# EAGLE design quad-wireless-switch (EAGLE 9.3.0)
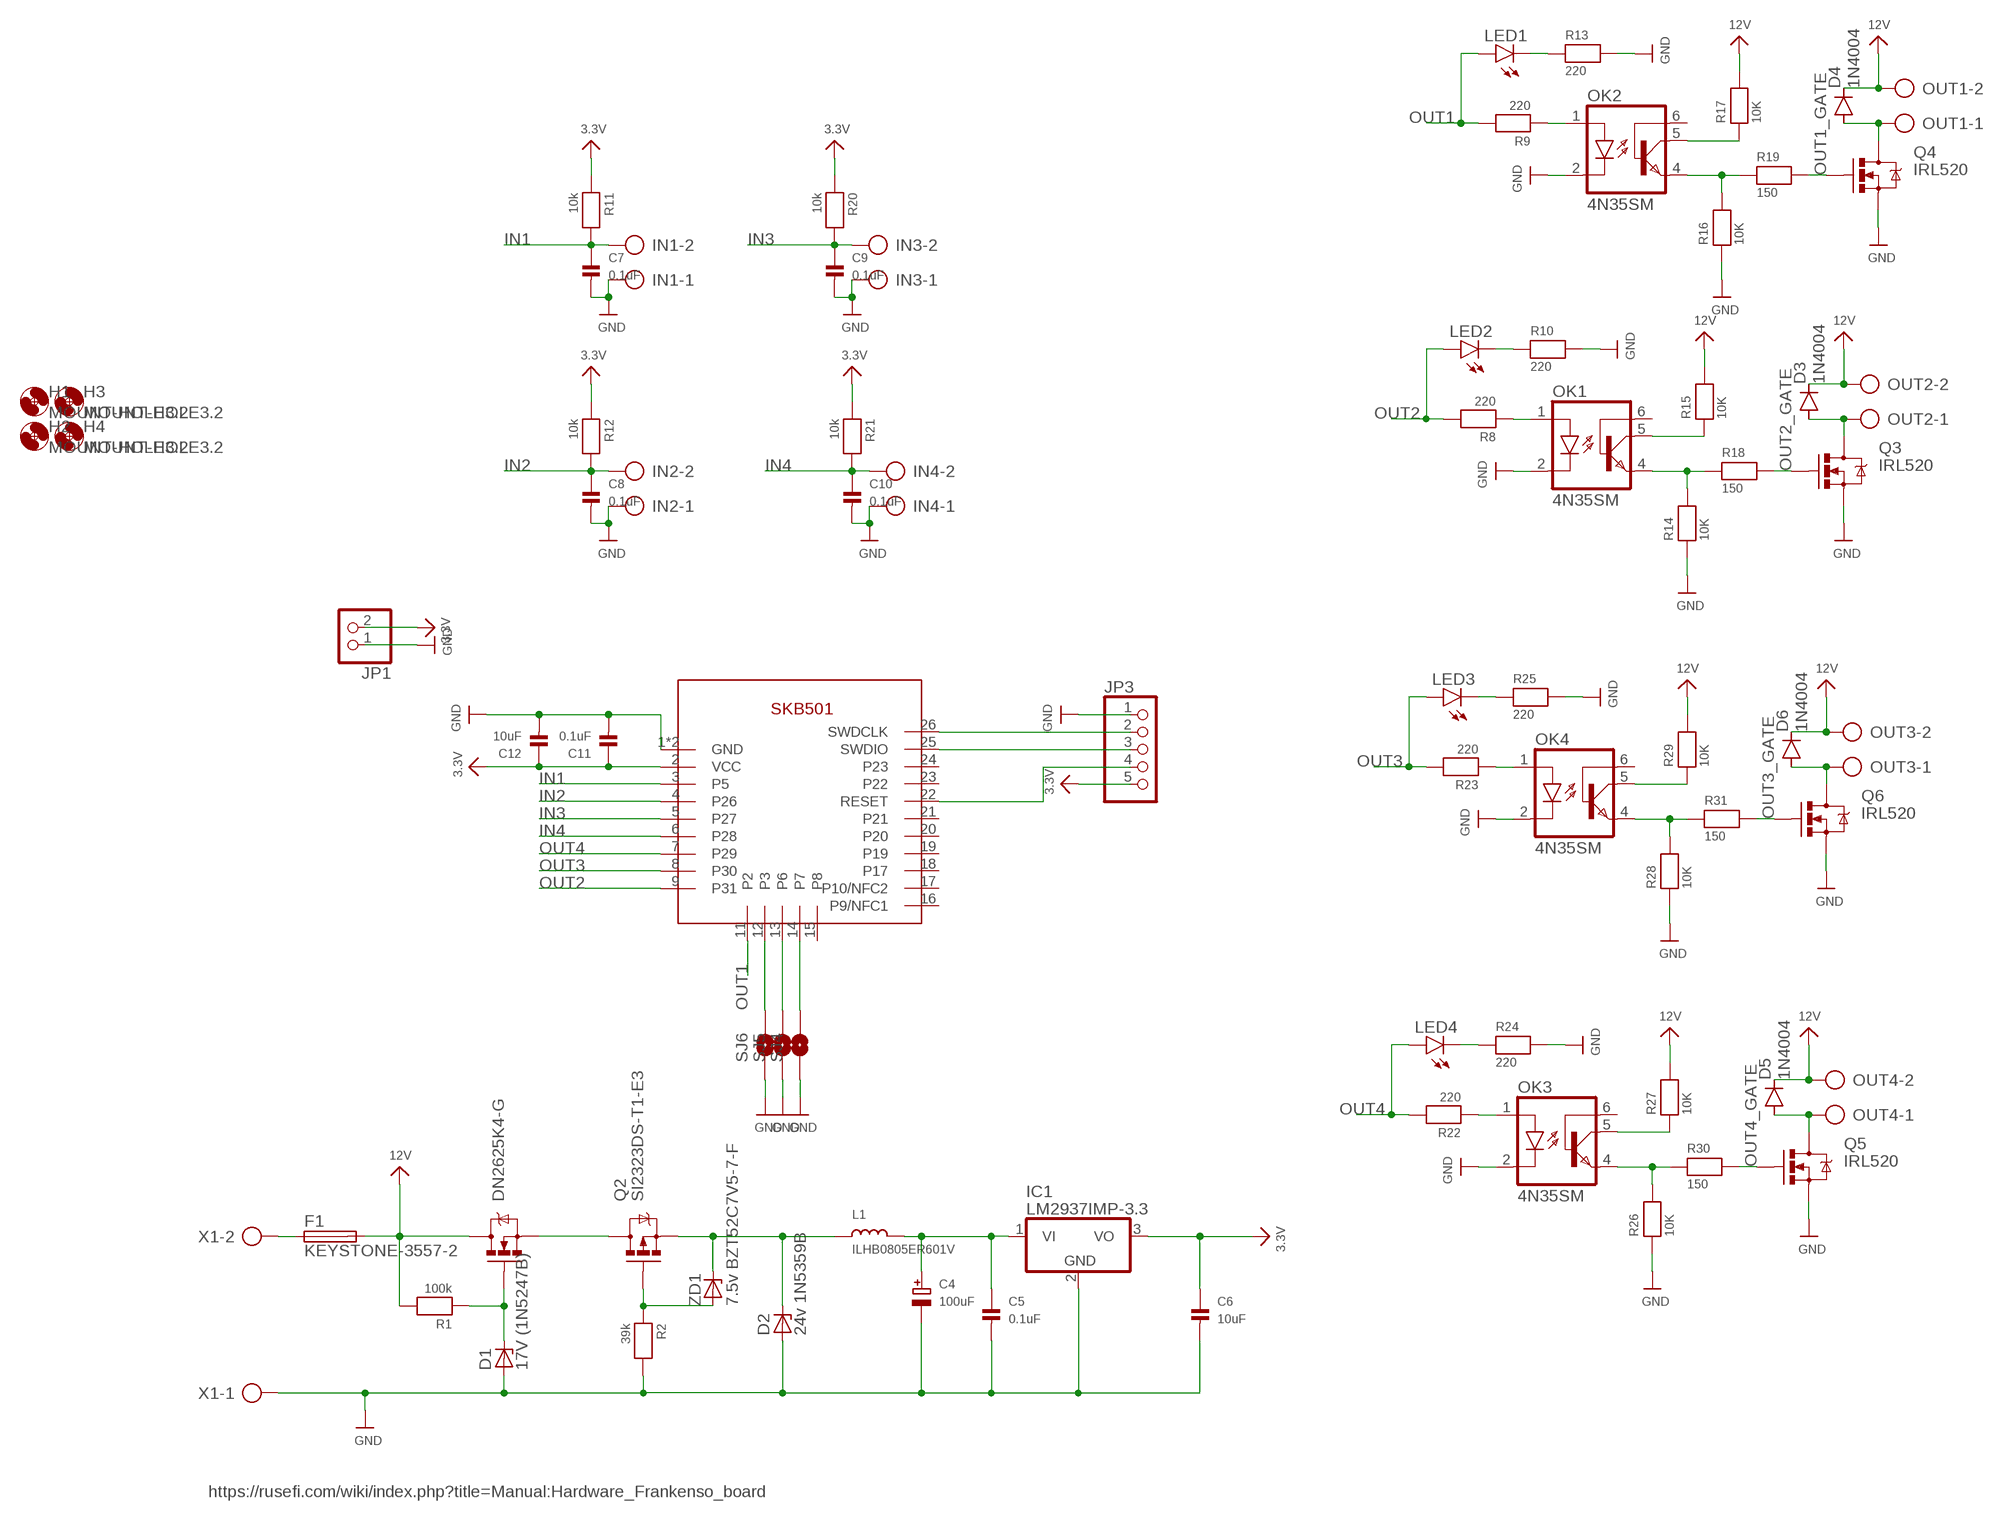
[diagram p0: schematic, sheet 1]

## Parts
C4  100uF  CAP_ELECTROLYTICPANASONIC_D  [PANASONIC_D]
C5  0.1uF  CAP_CERAMIC0805  [0805]
C6  10uF  CAP_CERAMIC0805  [0805]
C7  0.1uF  CAP_CERAMIC0805  [0805]
C8  0.1uF  CAP_CERAMIC0805  [0805]
C9  0.1uF  CAP_CERAMIC0805  [0805]
C10  0.1uF  CAP_CERAMIC0805  [0805]
C11  0.1uF  CAP_CERAMIC0805  [0805]
C12  10uF  CAP_CERAMIC0805  [0805]
D1  17V (1N5247B)  ZENER-DIODEZD-5  [ZDIO-5]
D2  24v 1N5359B  ZPY  [DO41Z10]
D3  1N4004  [DO41-10]
D4  1N4004  [DO41-10]
D5  1N4004  [DO41-10]
D6  1N4004  [DO41-10]
F1  KEYSTONE-3557-2  [KEYSTONE-3557-2]
H1  MOUNT-HOLE3.2  [3,2]
H2  MOUNT-HOLE3.2  [3,2]
H3  MOUNT-HOLE3.2  [3,2]
H4  MOUNT-HOLE3.2  [3,2]
IC1  LM2937IMP-3.3  LM2937  [TO263-3]
IN1  AK500/2-H  [AK500/2-H]
IN2  AK500/2-H  [AK500/2-H]
IN3  AK500/2-H  [AK500/2-H]
IN4  AK500/2-H  [AK500/2-H]
JP1  PINHD-1X2  [1X02]
JP3  PINHD-1X5  [1X05]
L1  ILHB0805ER601V  INDUCTOR0805  [0805]
LED1  LED5MM  [LED5MM]
LED2  LED5MM  [LED5MM]
LED3  LED5MM  [LED5MM]
LED4  LED5MM  [LED5MM]
OK1  4N35SM  [DIL6-SMD]
OK2  4N35SM  [DIL6-SMD]
OK3  4N35SM  [DIL6-SMD]
OK4  4N35SM  [DIL6-SMD]
OUT1  AK500/2-H  [AK500/2-H]
OUT2  AK500/2-H  [AK500/2-H]
OUT3  AK500/2-H  [AK500/2-H]
OUT4  AK500/2-H  [AK500/2-H]
Q1  DN2625K4-G  MOSFET-NCHANNELFDD8780  [DPAK]
Q2  SI2323DS-T1-E3  MOSFET-PCHANNEL  [SOT23-3]
Q3  IRL520  MOSFET-NCHANNELFQP30N06L  [TO220V]
Q4  IRL520  MOSFET-NCHANNELFQP30N06L  [TO220V]
Q5  IRL520  MOSFET-NCHANNELFQP30N06L  [TO220V]
Q6  IRL520  MOSFET-NCHANNELFQP30N06L  [TO220V]
R1  100k  RESISTOR0805  [0805]
R2  39k  RESISTOR0805  [0805]
R8  220  RESISTOR0805  [0805]
R9  220  RESISTOR0805  [0805]
R10  220  RESISTOR0805  [0805]
R11  10k  RESISTOR0805  [0805]
R12  10k  RESISTOR0805  [0805]
R13  220  RESISTOR0805  [0805]
R14  10K  RESISTOR0805  [0805]
R15  10K  RESISTOR0805  [0805]
R16  10K  RESISTOR0805  [0805]
R17  10K  RESISTOR0805  [0805]
R18  150  RESISTOR0805  [0805]
R19  150  RESISTOR0805  [0805]
R20  10k  RESISTOR0805  [0805]
R21  10k  RESISTOR0805  [0805]
R22  220  RESISTOR0805  [0805]
R23  220  RESISTOR0805  [0805]
R24  220  RESISTOR0805  [0805]
R25  220  RESISTOR0805  [0805]
R26  10K  RESISTOR0805  [0805]
R27  10K  RESISTOR0805  [0805]
R28  10K  RESISTOR0805  [0805]
R29  10K  RESISTOR0805  [0805]
R30  150  RESISTOR0805  [0805]
R31  150  RESISTOR0805  [0805]
SJ4  SOLDERJUMPERNO  [SJ_2S-NO]
SJ5  SOLDERJUMPERNO  [SJ_2S-NO]
SJ6  SOLDERJUMPERNO  [SJ_2S-NO]
U2  SDB501  [SKB501]
X1  AK500/2-H  [AK500/2-H]
ZD1  7.5v BZT52C7V5-7-F  ZD-SOD123  [SOD123]

## Nets
3.3V: C6.1 C11.1 C12.1 IC1.3(VO) JP1.2 JP3.5 R11.1 R12.1 R20.1 R21.1 U2.2(VCC)
12V: D3.C D4.C D5.C D6.C F1.R1 F1.R2 OUT1.2 OUT2.2 OUT3.2 OUT4.2 Q1.4(D) R1.2 R15.2 R17.2 R27.2 R29.2
GND: C4.- C5.2 C6.2 C7.2 C8.2 C9.2 C10.2 C11.2 C12.2 D1.A D2.A IC1.2(GND) IN1.1 IN2.1 IN3.1 IN4.1 JP1.1 JP3.1 OK1.2(C) OK2.2(C) OK3.2(C) OK4.2(C) Q3.3(S) Q4.3(S) Q5.3(S) Q6.3(S) R2.2 R10.2 R13.2 R14.1 R16.1 R24.2 R25.2 R26.1 R28.1 SJ4.1 SJ5.1 SJ6.1 U2.1(GND) U2.10(GND) X1.1
IN1: C7.1 IN1.2 R11.2 U2.3(P5)
IN2: C8.1 IN2.2 R12.2 U2.4(P26)
IN3: C9.1 IN3.2 R20.2 U2.5(P27)
IN4: C10.1 IN4.2 R21.2 U2.6(P28)
N$1: LED1.K(C) R13.1
N$2: OK2.4(EMI) R16.2 R19.1
N$3: D3.A OUT2.1 Q3.2(D)
N$4: LED2.K(C) R10.1
N$5: F1.L1 F1.L2 X1.2
N$6: D4.A OUT1.1 Q4.2(D)
N$7: SJ4.2 U2.14(P7)
N$8: OK1.5(COL) R15.1
N$9: SJ5.2 U2.13(P6)
N$10: SJ6.2 U2.12(P3)
N$11: D1.C Q1.1(G) R1.1
N$13: Q1.3(S) Q2.3(D)
N$14: Q2.1(G) R2.1 ZD1.A
N$15: D2.C L1.1 Q2.2(S) ZD1.C
N$17: C4.+ C5.1 IC1.1(VI) L1.2
N$18: OK1.1(A) R8.1
N$21: OK2.5(COL) R17.1
N$22: OK1.4(EMI) R14.2 R18.1
N$23: OK2.1(A) R9.1
N$24: D6.A OUT3.1 Q6.2(D)
N$25: LED3.K(C) R25.1
N$26: OK4.5(COL) R29.1
N$27: OK4.1(A) R23.1
N$28: OK4.4(EMI) R28.2 R31.1
N$29: D5.A OUT4.1 Q5.2(D)
N$30: LED4.K(C) R24.1
N$31: OK3.5(COL) R27.1
N$32: OK3.1(A) R22.1
N$33: OK3.4(EMI) R26.2 R30.1
N$36: JP3.2 U2.26(SWDCLK)
N$37: JP3.3 U2.25(SWDIO)
N$38: JP3.4 U2.22(RESET)
OUT1: LED1.A R9.2 U2.11(P2)
OUT1_GATE: Q4.1(G) R19.2
OUT2: LED2.A R8.2 U2.9(P31)
OUT2_GATE: Q3.1(G) R18.2
OUT3: LED3.A R23.2 U2.8(P30)
OUT3_GATE: Q6.1(G) R31.2
OUT4: LED4.A R22.2 U2.7(P29)
OUT4_GATE: Q5.1(G) R30.2
Unconnected: OK1.6(BAS) OK2.6(BAS) OK3.6(BAS) OK4.6(BAS) U2.15(P8) U2.16(P9/NFC1) U2.17(P10/NFC2) U2.18(P17) U2.19 U2.20 U2.21 U2.23(P22) U2.24(P23)

## Notes on the sheet
- https://rusefi.com/wiki/index.php?title=Manual:Hardware_Frankenso_board

## Library data of the parts
C4 = microbuilder:CAP_ELECTROLYTIC: Electrolytic Capacitors SMT PANASONIC_C - Size C Panasonic Electrolytic Aluminum Capacitor 47µF 16V 20% Electrolytic Capacitor [Digikey: PCE3890TR-ND] PANASONIC_D - Size D Panasonic Electrolytic Aluminum Capacitor 100µF 25V 20% Electrolytic Capacitor [Digikey: PCE3898TR-ND] PTH 3.5 mm grid, 8 mm diameter ... 3.5 mm grid, 10 mm diameter ...
C5-C12 = microbuilder:CAP_CERAMIC: Ceramic Capacitors 0402 - 0402 Surface Mount Capacitors 16pF 50V 5% [Digikey: 445-4899-2-ND] 18pF 50V 5% [Digikey: 490-1281-2-ND] 22pF 50V 5% [Digikey: 490-1283-2-ND] 68pF 50V 5% [Digikey: 490-1289-2-ND] 0.1uF 10V 10% [Digikey: 490-1318-2-ND] 1.0uF 6.3V 10% [Digikey: 490-1320-2-ND] 0603 - 0603 Surface Mount Capacitors 16 pF 50V 5% [Digikey: 445-5051-2-ND] 22 pF 50V [Digikey: PCC220ACVTR-ND] 33 pF 50V 5% [Digikey: 490-1415-1-ND] 56pF 50V 5% [Digikey: 490-1421-1-ND] 220pF 50V 5% [Digikey: 445-1285-1-ND] 680 pF 50V 2200 pF 50V 5% C0G [Digikey: 445-1297-1-ND] 5600 pF 100V 5% X7R [Digikey: 478-3711-1-ND] 0.1 µF 25V 10% [Digikey: PCC2277TR-ND] 0.22 µF 16V 10% X7R [Digikey: 445-1318-1-ND] 1.0 µF 25V 10% [Digikey: 445-5146-2-ND] 0603 - RF Specific 3pF 250V +/-0.1pF RF [Digikey: 712-1347-1-ND] 18 pF 250V 5% [Digikey: 478-3505-1-ND or 712-1322-1-ND] 56 pF 250V 5% C0G RF [Digikey: 490-4867-1-ND] 68 pF 250V RF [Digikey: 490-4868-1-ND] 0805 - 0805 Surface Mount Capacitors 220 pF 250V 2% RF Ceramic Capacitor [Digikey: 712-1398-1-ND] 1000 pF 50V 2% NP0 Ceramic Capacitor [Digikey: 478-3760-1-ND] 0.1 µF 25V 10% Ceramic Capacitor [Digikey: PCC1828TR-ND] 1.0 µF 16V 10% Ceramic Capacitor[Digikey: 490-1691-2-ND] 10.0 µF 10V 10% Ceramic Capacitor[Digikey: 709-1228-1-ND] 10.0 uF 16V 10% Ceramic Capacitor [Digikey: 478-5165-2-ND] 47 uF 6.3V 20% Ceramic Capacitor [Digikey: 587-1779-1-ND or 399-5506-1-ND] 1206 - 1206 Surface Mount Capacitors 47uF 10V 20% Ceramic Capacitor [Digikey: 490-5528-1-ND or 399-5508-1-ND or 445-6010-1-ND] 100uF 6.3V -20%, +80% Y5V Ceramic Capacitor (Digikey: 490-4512-1-ND, Mouser: 81-GRM31CF50J107ZE1L)
D1 = diode:ZENER-DIODE: Z-Diode
D2 = diode:ZPY: Z DIODE 1 W
D3-D6 = diode:1N4004: DIODE general purpose rectifier, 1 A
F1 = keves-ng:KEYSTONE-3557-2: THM 2 in 1 Auto Blade Holder P/N 3557-2 Fuse Reference: Littelfuse ATO 257 series / Bussmann ATC series / APR / Littelfuse 891,897 series / Bussmann ATM-LP series / APS or equivalent http://www.keyelco.com/product.cfm/product_id/296
H1-H4 = holes:MOUNT-HOLE: MOUNTING HOLE with drill center marker
IC1 = linear:LM2937: LM2937-2.5, LM2937-3.3 400mA and 500mA Voltage Regulators Source: http://cache.national.com/ds/LM/LM2937-2.5.pdf
IN1-IN4 OUT1-OUT4 X1 = con-ptr500:AK500/2-H: CONNECTOR Aug. 2004 / PTR Meßtechnik: Die Bezeichnung der Serie AK505 wurde geändert. Es handelt sich hierbei um AK500 in horizontaler Ausführung.; OC_FARNELL: unknown; OC_NEWARK: unknown
JP1 = pinhead:PINHD-1X2: PIN HEADER
JP3 = pinhead:PINHD-1X5: PIN HEADER
L1 = microbuilder:INDUCTOR: Inductors 0603: 10nH Ceramic Inductor - microwire antenna/RF (Digikey: 712-1434-2-ND) 0805: 560nH Ceramic Inductor - RF (Digikey: 553-1047-1-ND) 270nH Ceramic Inductor - Q = 40@250MHz, +-5%, 1 Ohm DC Resistance (Digikey: 535-10506-2-ND) 1007 (2518 Metric) SMT: 10µH 10% 250mOhm 820mA 1007 Inductor (Digikey: 587-2189-1-ND) 22µH 10% 500mOhm 580mA 1007 Inductor (Digikey: 587-2190-1-ND) 47µH 10% 950mOhm 420mA 1007 Inductor (Digikey: 587-2191-1-ND) 47µH 5% 100mOhm 1A 1008 Inductor (Digikey: 732-1816-1-ND) 5.0x5.0mm (Taiyo Yuden NR5040 Series) 6.8µH 20% 2.3A 64mOhm Inductor (Digikey: 587-2374-2-ND) 5.0x5.0mm (TDK VLC5045 Series) 4.7µH 20% 3.3A 34mOhm Inductor (Digikey: 445-6526-1-ND) 6.8µH 20% 2.7A 46mOhm Inductor (Digikey: 445-6527-1-ND) 6.0x6.0mm (TDK VLC6045 Series) 4.7µH 20% 3.8A 27mOhm Inductor (Digikey: 445-6538-2-ND) 6.8µH 20% 3A 41mOhm Inductor (Digikey: 445-6540-1-ND) 6.2µH 30% 2.2A 45mOhm Inductor (Digikey: SRR5028-6R2YCT-ND) - Not TDK VLC6045 but footprint should match 6.0x6.0mm (TDK SLF6045 Series) 6.8uH 30% 2A 33mOhm Inductor (Digikey: 445-4572-1-ND, Mouser: 810-SLF645T6R8N2R0PF)
LED1-LED4 = led:LED: LED OSRAM: - CHIPLED LG R971, LG N971, LY N971, LG Q971, LY Q971, LO R971, LY R971 LH N974, LH R974 LS Q976, LO Q976, LY Q976 LO Q996 - Hyper CHIPLED LW Q18S LB Q993, LB Q99A, LB R99A - SideLED LS A670, LO A670, LY A670, LG A670, LP A670 LB A673, LV A673, LT A673, LW A673 LH A674 LY A675 LS A676, LA A676, LO A676, LY A676, LW A676 LS A679, LY A679, LG A679 - Hyper Micro SIDELED® LS Y876, LA Y876, LO Y876, LY Y876 LT Y87S - SmartLED LW L88C, LW L88S LB L89C, LB L89S, LG L890 LS L89K, LO L89K, LY L89K LS L896, LA L896, LO L896, LY L896 - TOPLED LS T670, LO T670, LY T670, LG T670, LP T670 LSG T670, LSP T670, LSY T670, LOP T670, LYG T670 LG T671, LOG T671, LSG T671 LB T673, LV T673, LT T673, LW T673 LH T674 LS T676, LA T676, LO T676, LY T676, LB T676, LH T676, LSB T676, LW T676 LB T67C, LV T67C, LT T67C, LS T67K, LO T67K, LY T67K, LW E67C LS E67B, LA E67B, LO E67B, LY E67B, LB E67C, LV E67C, LT E67C LW T67C LS T679, LY T679, LG T679 LS T770, LO T770, LY T770, LG T770, LP T770 LB T773, LV T773, LT T773, LW T773 LH T774 LS E675, LA E675, LY E675, LS T675 LS T776, LA T776, LO T776, LY T776, LB T776 LHGB T686 LT T68C, LB T68C - Hyper Mini TOPLED® LB M676 - Mini TOPLED Santana® LG M470 LS M47K, LO M47K, LY M47K Source: http://www.osram.convergy.de LUXEON: - LUMILED® LXK2-PW12-R00, LXK2-PW12-S00, LXK2-PW14-U00, LXK2-PW14-V00 LXK2-PM12-R00, LXK2-PM12-S00, LXK2-PM14-U00 LXK2-PE12-Q00, LXK2-PE12-R00, LXK2-PE12-S00, LXK2-PE14-T00, LXK2-PE14-U00 LXK2-PB12-K00, LXK2-PB12-L00, LXK2-PB12-M00, LXK2-PB14-N00, LXK2-PB14-P00, LXK2-PB14-Q00 LXK2-PR12-L00, LXK2-PR12-M00, LXK2-PR14-Q00, LXK2-PR14-R00 LXK2-PD12-Q00, LXK2-PD12-R00, LXK2-PD12-S00 LXK2-PH12-R00, LXK2-PH12-S00 LXK2-PL12-P00, LXK2-PL12-Q00, LXK2-PL12-R00 Source: www.luxeon.com KINGBRIGHT: KA-3528ASYC Source: www.kingbright.com
OK1-OK4 = optocoupler:4N*?M: General Purpose 6-Pin Phototransistor Optocouplers Source: http://www.fairchildsemi.com/ds/4N/4N35-M.pdf; MF: FAIRCHILD SEMICONDUCTOR; MPN: 4N35S-M; OC_FARNELL: 1021179; OC_NEWARK: 67K2285
Q1 = SparkFun-DiscreteSemi:MOSFET-NCHANNEL: Common NMOSFET Parts MFG P/N Store ID Prod ID FDD8780 TRANS-09984 SI7820DN TRANS-11055 FDS6630A IC-08089 2N7002PW TRANS-11151 FQP30N06L COM-10213 TRANS-10060 BSS123LT1G TRANS-08345 BSS138 TRANS-00830 BS170 2N7000; PROD_ID: TRANS-09984
Q2 = SparkFun-DiscreteSemi:MOSFET-PCHANNEL: Generic PMOSFET IRLML2244 - TRANS-11153 (SOT-23 -20V -4.3A) (1.Gate 2.Source 3.Drain) FQP27P06 - COM-10349 <http://www.sparkfun.com/products/10349> (TO-220 -60V -27A) (1.Gate 2.Source 3.Drain); PROD_ID: TRANS-08285
Q3-Q6 = keves-ng:MOSFET-NCHANNEL: Common NMOSFET Parts MFG P/N Store ID Prod ID FDD8780 TRANS-09984 SI7820DN TRANS-11055 FDS6630A IC-08089 2N7002PW TRANS-11151 FQP30N06L COM-10213 TRANS-10060 BSS123LT1G TRANS-08345 BSS138 TRANS-00830 BS170 2N7000; PROD_ID: TRANS-10060
R1 R2 R8-R31 = microbuilder:RESISTOR: Resistors 0402 - 0402 Surface Mount Package 22 Ohm 1% 1/16W [Digikey: 311-22.0LRTR-ND] 33 Ohm 5% 1/16W 1.0K 5% 1/16W 1.5K 5% 1/16W 2.0K 1% 1/16W 10.0K 1% 1/16W [Digikey: 311-10.0KLRTR-ND] 10.0K 5% 1/16W [Digikey: RMCF0402JT10K0TR-ND] 12.1K 1% 1/16W [Digikey: 311-22.0LRTR-ND] 100.0K 5% 1/16W 0603 - 0603 Surface Mount Package 0 Ohm 1/10 Watt 1% Resistor 15 Ohm 1/10 Watt 1% Resistor 33 Ohm 1/10 Watt 1% Resistor 49.9 Ohm 1/10 Watt 1% Resistor 100 Ohm 1/10 Watt 1% Resistor 150 Ohm 1/10 Watt 1% Resistor 240 Ohm 1/10 Watt 1% Resistor 390 Ohm 1/10 Watt 1% Resistor 560 Ohm 1/10 Watt 1% Resistor 680 Ohm 1/10 Watt 1% Resistor 750 Ohm 1/10 Watt 1% Resistor 1.0K Ohm 1/10 Watt 1% Resistor 1.5K Ohm 1/10 Watt 1% Resistor 2.0K Ohm 1/10 Watt 1% Resistor 2.2K Ohm 1/10 Watt 1% Resistor 3.3K Ohm 1/10 Watt 1% Resistor 4.7K Ohm 1/10 Watt 1% Resistor 10.0K Ohm 1/10 Watt 1% Resistor 12.0K Ohm 1/10 Watt 1% Resistor 12.1K Ohm 1/10 Watt 1% Resistor 20.0K Ohm 1/10 Watt 1% Resistor 33.0K Ohm 1/10 Watt 1% Resistor 100.0K Ohm 1/10 Watt 1% Resistor 0805 - 0805 Surface Mount Package 0 Ohm 1/8 Watt 1% Resistor 33 Ohm 1/8 Watt 1% Resistor 100 Ohm 1/8 Watt 1% Resistor 150 Ohm 1/8 Watt 1% Resistor 200 Ohm 1/8 Watt 1% Resistor 240 Ohm 1/8 Watt 1% Resistor 330 Ohm 1/8 Watt 1% Resistor 390 Ohm 1/8 Watt 1% Resistor 470 Ohm 1/8 Watt 1% Resistor 1.0K Ohm 1/8 Watt 1% Resistor 1.5K Ohm 1/8 Watt 1% Resistor 2.0K Ohm 1/8 Watt 1% Resistor 4.7K Ohm 1/8 Watt 1% Resistor 5.1K Ohm 1/8 Watt 1% Resistor 5.6K Ohm 1/8 Watt 1% Resistor 10.0K Ohm 1/8 Watt 1% Resistor 22.0K Ohm 1/8 Watt 1% Resistor 33.0K Ohm 1/8 Watt 1% Resistor 100K Ohm 1/8 Watt 1% Resistor 1206 - 1206 Surface Mount Package 2012 - 2010 Surface Mount Package 0.11 Ohm 1/2 Watt 1% Resistor - Digikey: RHM.11UCT-ND
SJ4-SJ6 = SparkFun-Retired:SOLDERJUMPER: Solder Jumper Standard SMD solder jumper. Used to automate production. Two varients : Normally Open and Normally Closed are the same, but have different paste layers. NC will have a large amount of paste and should jumper during reflow.
U2 = shlomo:SDB501
ZD1 = diodes:ZD-: Zener diode

## Net classes
0 default: width 0.254 mm
1 3.3v: width 0.406 mm

## Board
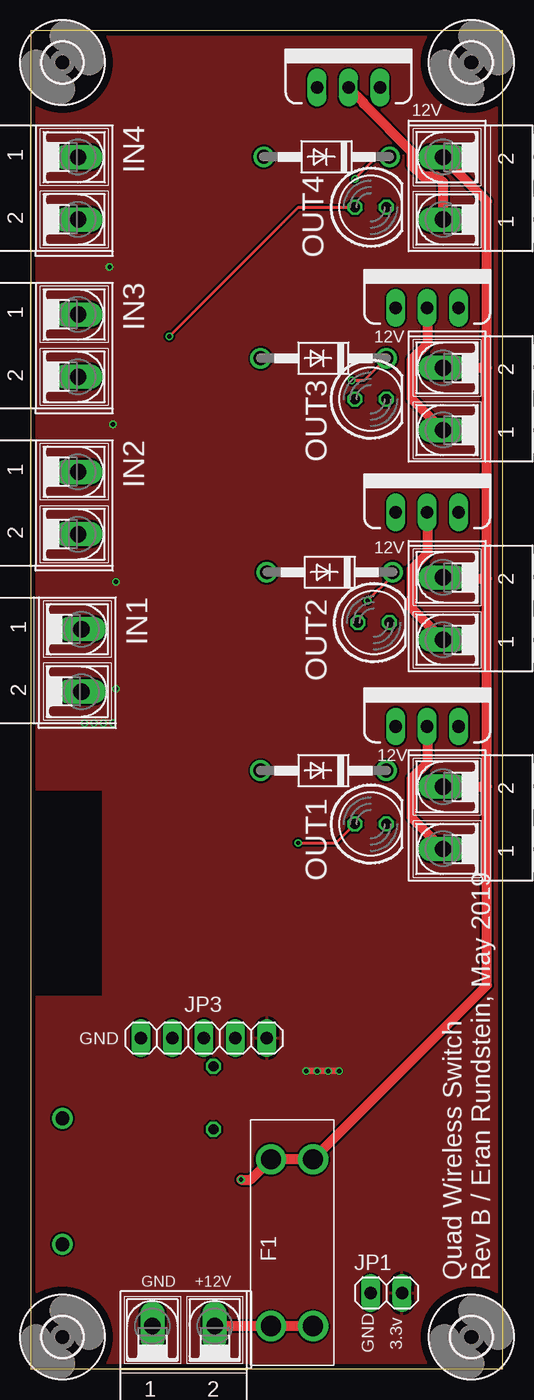
[diagram p1: board, top side]
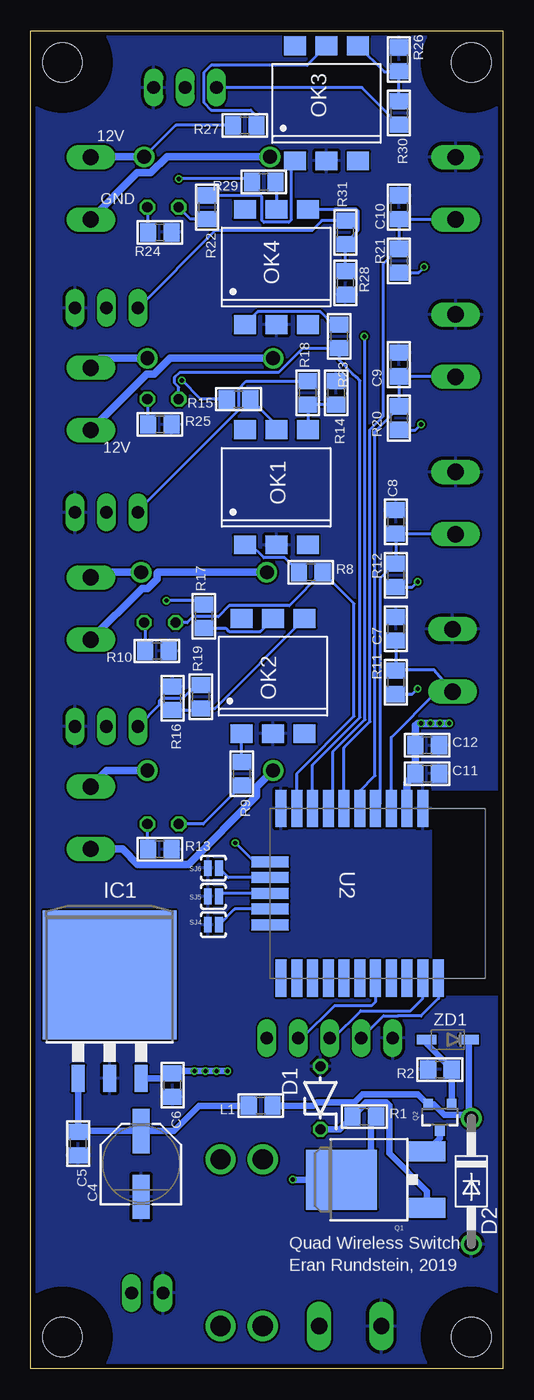
[diagram p2: board, bottom side, seen from below]

Size 38.1 x 107.95 mm. Coordinates in mm from the lower left corner, seen from the top.
Outline: 0,0 38.1,0 38.1,107.95 0,107.95 0,0
Copper layers (1*16): Top 0.035559375mm / dielectric 1.6mm / Bottom 0.035559375mm
Design rules "oshpark-2layer-2019-04": minimum track width 6mil, minimum drill 10mil, track to track 6mil, track to pad 6mil, pad to pad 6mil, via to via 6mil, smd to smd 6mil, copper to edge 15mil, drill to drill 6mil, minimum pad ring 5mil, minimum via ring 5mil, stop-mask expansion 2.5mil, vias tented up to drill 0mil, thermal gap 10mil

### Footprints (pad centres in the part's own frame; a part is rotated, then mirrored left to right if it is on the bottom)
PANASONIC_D = smd 3.556 x 1.4: + 2.654,0; - -2.654,0
0805 = smd 1.3 x 1.5: 1 -0.95,0; 2 0.95,0
ZDIO-5 = drill 0.813 octagon: A 2.54,0; C -2.54,0
DO41Z10 = drill 1.118: A 5.08,0; C -5.08,0
DO41-10 = drill 1.118: A 5.08,0; C -5.08,0
KEYSTONE-3557-2 = drill 1.626: L1 -6.731,1.702; L2 -6.731,-1.702; R1 6.731,1.702; R2 6.731,-1.702
3,2 = hole 3.2: 0,0
TO263-3 = smd 1.067 x 2.159: 1 -2.54,-5.791; 2 0,-5.791; 3 2.54,-5.791 | smd 10.8 x 10.41: TAB 0,2.54
AK500/2-H = drill 1.321 long: 1 -2.515,0; 2 2.515,0
1X02 = drill 1.016 long: 1 -1.27,0; 2 1.27,0
1X05 = drill 1.016 long: 1 -5.08,0; 2 -2.54,0; 3 0,0; 4 2.54,0; 5 5.08,0
LED5MM = drill 0.813 octagon: A -1.27,0; K 1.27,0
DIL6-SMD = smd 1.78 x 1.52: 1 -2.54,-4.645; 2 0,-4.645; 3 2.54,-4.645; 4 2.54,4.645; 5 0,4.645; 6 -2.54,4.645
DPAK = smd 1.6 x 3: 1 -2.28,-5.31; 3 2.28,-5.31 | smd 4.826 x 5.715: 4 0,1.588
SOT23-3 = smd 0.8 x 0.9: 1 -0.95,-1; 2 0.95,-1; 3 0,1.1
TO220V = drill 1.016 long: 1 -2.54,0; 2 0,0; 3 2.54,0
SJ_2S-NO = smd 0.635 x 1.27: 1 -0.45,0; 2 0.45,0
SKB501 = smd 0.9 x 3: 1 12.33,6.85; 2 11.06,6.85; 3 9.79,6.85; 4 8.52,6.85; 5 7.25,6.85; 6 5.98,6.85; 7 4.71,6.85; 8 3.44,6.85; 9 2.17,6.85; 10 0.9,6.85; 16 0.9,-6.85; 17 2.17,-6.85; 18 3.44,-6.85; 19 4.71,-6.85; 20 5.98,-6.85; 21 7.25,-6.85; 22 8.52,-6.85; 23 9.79,-6.85; 24 11.06,-6.85; 25 12.33,-6.85; 26 13.6,-6.85 | smd 3 x 0.9: 11 0,2.54; 12 0,1.27; 13 0,0; 14 0,-1.27; 15 0,-2.54
SOD123 = smd 1.6 x 0.8: A 1.7,0; C -1.7,0

### Placement (x,y rotation side)
C4  29.21,16.51 90 bottom
C5  34.29,18.16 270 bottom
C6  26.67,22.86 270 bottom
C7  8.64,59.69 90 bottom
C8  8.64,68.33 90 bottom
C9  8.38,81.03 90 bottom
C10  8.38,93.73 90 bottom
C11  6.1,48.01 0 bottom
C12  6.1,50.29 0 bottom
D1  14.73,21.84 90 bottom
D2  2.54,15.11 270 bottom
D3  24.13,64.26 180 top
D4  23.62,48.26 180 top
D5  23.88,97.79 180 top
D6  23.62,81.53 180 top
F1  21.08,10.16 90 top
H1  2.54,2.54 0 top
H2  35.56,2.54 0 top
H3  2.54,105.41 0 top
H4  35.56,105.41 0 top
IC1  31.75,29.21 0 bottom
IN1  4.06,57.15 270 top
IN2  3.81,69.85 270 top
IN3  3.81,82.55 270 top
IN4  3.81,95.25 270 top
JP1  28.7,6.1 0 top
JP3  13.97,26.67 0 top
L1  19.56,21.21 180 bottom
LED1  27.43,43.94 0 top
LED2  27.69,60.2 0 top
LED3  27.43,78.23 0 top
LED4  27.43,93.73 0 top
OK1  18.29,71.12 0 bottom
OK2  18.54,55.88 0 bottom
OK3  14.22,102.11 0 bottom
OK4  18.29,88.9 0 bottom
OUT1  33.27,44.45 90 top
OUT2  33.27,61.34 90 top
OUT3  33.27,78.26 90 top
OUT4  33.27,95.25 90 top
Q1  11.43,15.24 90 bottom
Q2  5.08,20.32 180 bottom
Q3  32,69.09 0 top
Q4  32,51.82 0 top
Q5  25.65,103.38 0 top
Q6  32,85.6 0 top
R1  11.18,20.32 0 bottom
R2  5.08,24.13 180 bottom
R8  15.49,64.26 0 bottom
R9  21.08,48.01 270 bottom
R10  27.94,57.91 0 bottom
R11  8.64,55.37 90 bottom
R12  8.64,64.01 90 bottom
R13  27.69,41.91 0 bottom
R14  13.46,78.74 270 bottom
R15  21.34,78.23 180 bottom
R16  26.67,54.1 270 bottom
R17  24.13,60.71 90 bottom
R18  15.75,78.74 90 bottom
R19  24.38,54.23 90 bottom
R20  8.38,76.71 90 bottom
R21  8.38,89.41 90 bottom
R22  23.88,93.73 270 bottom
R23  13.21,83.31 270 bottom
R24  27.69,91.69 0 bottom
R25  27.69,76.2 0 bottom
R26  8.38,105.66 270 bottom
R27  20.83,100.33 180 bottom
R28  12.7,87.63 90 bottom
R29  19.3,95.76 180 bottom
R30  8.38,101.35 270 bottom
R31  12.7,91.69 90 bottom
SJ4  23.37,35.81 0 bottom
SJ5  23.37,38.1 0 bottom
SJ6  23.37,40.39 0 bottom
U2  18.8,38.35 0 bottom
X1  12.32,3.43 0 top
ZD1  4.45,26.54 180 bottom

### Tracks (layer width: path | path; a pad name or v marks a point on that pad's centre or on a via)
3.3V  (via drill 0.35)
  Top 0.508: v22.23,24 v23.11,24 v24,24 v24.89,24
  Bottom 0.254: R11.1 7.3,54.42 v6.86,54.86 | R12.1 7.3,63.06 v6.86,63.5 | R20.1 7.05,75.76 v6.6,76.2 | R21.1 6.79,88.46 v6.35,88.9
  Bottom 0.508: IC1.3 26.67,23.42 C6.1 26.67,24 v24.89,24 v24,24 v23.11,24 v22.23,24
  Bottom 0.61: U2.2 7.74,47.32 C11.1 C12.1 7.05,51.88 6.86,52.07 v6.6,52.07 v5.84,52.07 v5.08,52.07 v4.32,52.07
  pour Top: -7.11,110.24 42.16,110.24 44.2,108.2 44.2,-2.03 42.42,-3.81 -2.03,-3.81 -3.05,-2.79 -3.05,105.92 -7.11,109.98
12V  (via drill 0.35)
  Top 0.254: v27.18,61.98 29.21,64.01 D3.C | v25.91,79.76 26.92,79.76 D6.C | v26.16,96.01 27.94,97.79 D5.C
  Top 0.813: 36.83,46.99 36.83,30.94 F1.R2 F1.R1 17.73,15.24 v16.97,15.24 | 36.83,46.99 36.83,63.75 | 36.83,63.75 36.83,80.77 | 36.83,80.77 36.83,94.21 OUT4.2 | OUT3.2 36.83,80.77 | OUT2.2 33.38,63.75 36.83,63.75 | OUT1.2 36.8,46.97 36.83,46.99
  Bottom 0.254: R17.2 24.45,61.98 v27.18,61.98 | R15.2 24.38,78.23 v25.91,79.76 | R29.2 20.51,96.01 v26.16,96.01 | R27.2 26.42,100.33 D5.C
  Bottom 0.508: v16.97,15.24 Q1.4 10.67,15.24 10.67,19.88 R1.2
  Bottom 0.61: D4.C 31.98,48.26 OUT1.2 | D3.C 32.87,64.26 OUT2.2 | D6.C 32.51,81.53 OUT3.2 | D5.C 33.25,97.79 OUT4.2
GND
  pour Bottom: -3.81,109.22 41.91,109.22 41.91,0 39.37,-2.54 -1.27,-2.54 -2.54,-1.27 -2.54,107.95
IN1
  Bottom 0.254: C7.1 8.64,56.39 | 8.64,56.39 R11.2 | 8.64,56.39 5.56,56.39 IN1.2 5.31,54.63 9.01,50.94 U2.3
IN2
  Bottom 0.254: 8.64,65.02 C8.1 8.6,67.33 IN2.2 | 8.64,65.02 R12.2 | 8.64,65.02 9.91,63.75 9.91,45.57 U2.4
IN3
  Bottom 0.254: IN3.2 8.34,80.03 C9.1 8.38,77.98 R20.2 8.38,77.55 10.31,75.62 10.31,47.85 11.55,46.62 U2.5
IN4
  Bottom 0.254: IN4.2 8.34,92.73 C10.1 8.38,90.42 | 8.38,90.42 R21.2 | U2.6 12.82,50.11 10.72,52.21 10.72,75.79 9.65,76.86 9.65,89.15 8.38,90.42
N$1
  Bottom 0.254: LED1.K 28.7,41.98 R13.1
N$2
  Bottom 0.254: R16.2 24.51,53.15 R19.1 23.25,53.28 OK2.4
N$3
  Top 0.813: Q3.2 32,65.77 30.73,64.5 30.73,61.37 OUT2.1
  Bottom 0.61: D3.A 27.84,64.26 27.91,64.19 27.91,63.73 28.67,62.97 29.13,62.97 OUT2.1
N$4
  Bottom 0.254: LED2.K 28.89,60.13 R10.1
N$5
  Top 0.813: F1.L2 F1.L1 X1.2
N$6
  Top 0.813: Q4.2 32,48.88 30.73,47.61 30.73,44.48 OUT1.1
  Bottom 0.61: D4.A 19.88,46.93 19.88,46.22 25.39,40.7 29.48,40.7 30.71,41.94 OUT1.1
N$7
  Bottom 0.254: U2.14 21.65,37.08 SJ4.2
N$8
  Bottom 0.254: OK1.5 18.29,76.13 R15.1
N$9
  Bottom 0.254: U2.13 22.66,38.35 SJ5.2
N$10
  Bottom 0.254: U2.12 22.16,39.62 SJ6.2
N$11
  Bottom 0.508: D1.C 13.14,19.3 R1.1 11.28,21.16 11.28,21.24 11.04,21.48 9.41,21.48 9.17,21.24 9.17,17.36 6.12,14.31 Q1.1
N$13
  Bottom 0.508: Q1.3 5.08,18.56 Q2.3
N$14
  Bottom 0.508: Q2.1 R2.1 4.97,24.97 4.97,25.05 6.14,26.22 ZD1.A
N$15
  Bottom 0.508: ZD1.C 2.75,20.4 D2.C 2.81,20.46 4.7,20.46 5.55,21.32 Q2.2 6.85,22.14 11.32,22.14 11.98,21.48 15.01,21.48 15.28,21.21 L1.1
N$17
  Bottom 0.508: IC1.1 C5.1 34.24,19.16 C4.+ 26.56,19.16 24.51,21.21 L1.2
N$18
  Bottom 0.254: R8.1 17.62,65.44 19.29,65.44 20.33,66.47 OK1.1
N$21
  Bottom 0.254: R17.1 22.36,59.76 22.09,59.49 19.58,59.49 OK2.5
N$22
  Bottom 0.254: R14.2 R18.1 OK1.4
N$23
  Bottom 0.254: R9.1 OK2.1
N$24
  Top 0.813: Q6.2 32,82.68 30.73,81.41 30.73,78.28 OUT3.1
  Bottom 0.61: OUT3.1 28.78,80.24 28.16,80.24 26.87,81.53 D6.A
N$25
  Bottom 0.254: R25.1 28.64,78.17 LED3.K
N$26
  Bottom 0.254: R29.1 18.29,95.69 OK4.5
N$27
  Bottom 0.254: R23.1 13.71,84.26 14.74,85.29 19.79,85.29 OK4.1
N$28
  Bottom 0.254: R28.2 R31.1 12.7,90.85 11.67,91.88 11.67,93.41 11.83,93.57 13.57,93.57 13.59,93.55 15.5,93.55 OK4.4
N$29
  Top 0.813: OUT4.1 33.27,95.76 32.82,96.22 31.64,96.22 30.73,97.12 30.73,98.21 26.87,102.07 26.87,102.16 Q5.2
  Bottom 0.61: D5.A 27.12,97.79 28.42,96.5 29.52,96.5 OUT4.1
N$30
  Bottom 0.254: R24.1 28.64,93.66 LED4.K
N$31
  Bottom 0.254: R27.1 19.88,101.1 20.35,101.58 23.55,101.58 24.16,102.19 24.16,104.57 23.55,105.18 15.8,105.18 OK3.5
N$32
  Bottom 0.254: R22.1 19.55,94.68 19.46,94.58 19.46,92.67 19.29,92.51 17.28,92.51 17.12,92.67 17.12,97.11 OK3.1
N$33
  Bottom 0.254: R30.1 8.38,104.65 | 8.38,104.65 R26.2 | OK3.4 9.58,104.65 8.38,104.65
N$36
  Bottom 0.254: JP3.2 9.63,28.47 8.46,28.47 8.43,28.45 6.6,28.45 5.2,29.86 U2.26
N$37
  Bottom 0.254: JP3.3 13.66,26.67 11.46,28.88 7.44,28.88 6.47,29.86 U2.25
N$38
  Bottom 0.254: U2.22 10.28,29.6 10.59,29.29 13.59,29.29 16.2,26.67 JP3.4
OUT1  (via drill 0.35)
  Top 0.254: v21.59,42.42 24.64,42.42 LED1.A
  Bottom 0.254: R9.2 24.2,43.94 LED1.A | U2.11 20.07,40.89 v21.59,42.42
OUT1_GATE
  Bottom 0.254: Q4.1 27.7,53.58 27.7,53.92 27.5,54.12 25.8,54.12 24.75,55.18 R19.2
OUT2
  Bottom 0.254: LED2.A 25.48,60.2 25,60.69 22.97,60.69 22.09,61.56 17.24,61.56 R8.2 12.73,62.45 12.7,62.42 12.01,61.72 12.01,52.65 16.63,48.02 U2.9
OUT2_GATE
  Bottom 0.254: R18.2 20.72,79.69 21.32,79.1 21.32,77.41 29.46,69.26 Q3.1
OUT3
  Bottom 0.254: LED3.A 26.16,79.19 26.49,79.52 26.49,80 26.07,80.42 18.08,80.42 16.13,82.36 R23.2 13.21,81.38 12.14,80.31 11.84,80.01 11.53,79.7 11.53,52.54 15.36,48.72 U2.8
OUT3_GATE
  Bottom 0.254: R31.2 14.6,92.64 15.4,91.85 23.21,91.85 Q6.1
OUT4  (via drill 0.35)
  Top 0.254: v11.18,83.31 21.59,93.73 LED4.A
  Bottom 0.254: R22.2 25.21,92.78 LED4.A | U2.7 13.72,45.57 13.72,49.78 11.12,52.38 11.12,83.26 v11.18,83.31
OUT4_GATE
  Bottom 0.254: R30.2 11.36,103.38 Q5.1

### Text on the board
tPlace: 12V | 12V | 12V | 12V | GND | 3.3v | GND
bPlace: Quad Wireless Switch | Eran Rundstein, 2019
tNames: GND | +12V | Quad Wireless Switch / Rev B / Eran Rundstein, May 2019
bNames: 12V | GND | 12V